# Altium schematic sheet FT65E_SATA.SchDoc: Yaesu FT-65E SATA-interface
size A4; Engineer: CT; SheetNumber: 1; SheetTotal: 1; SPICEModelCacheGVAACYAI: <root> / <DocumentId>GVAACYAI</DocumentId> / </root>
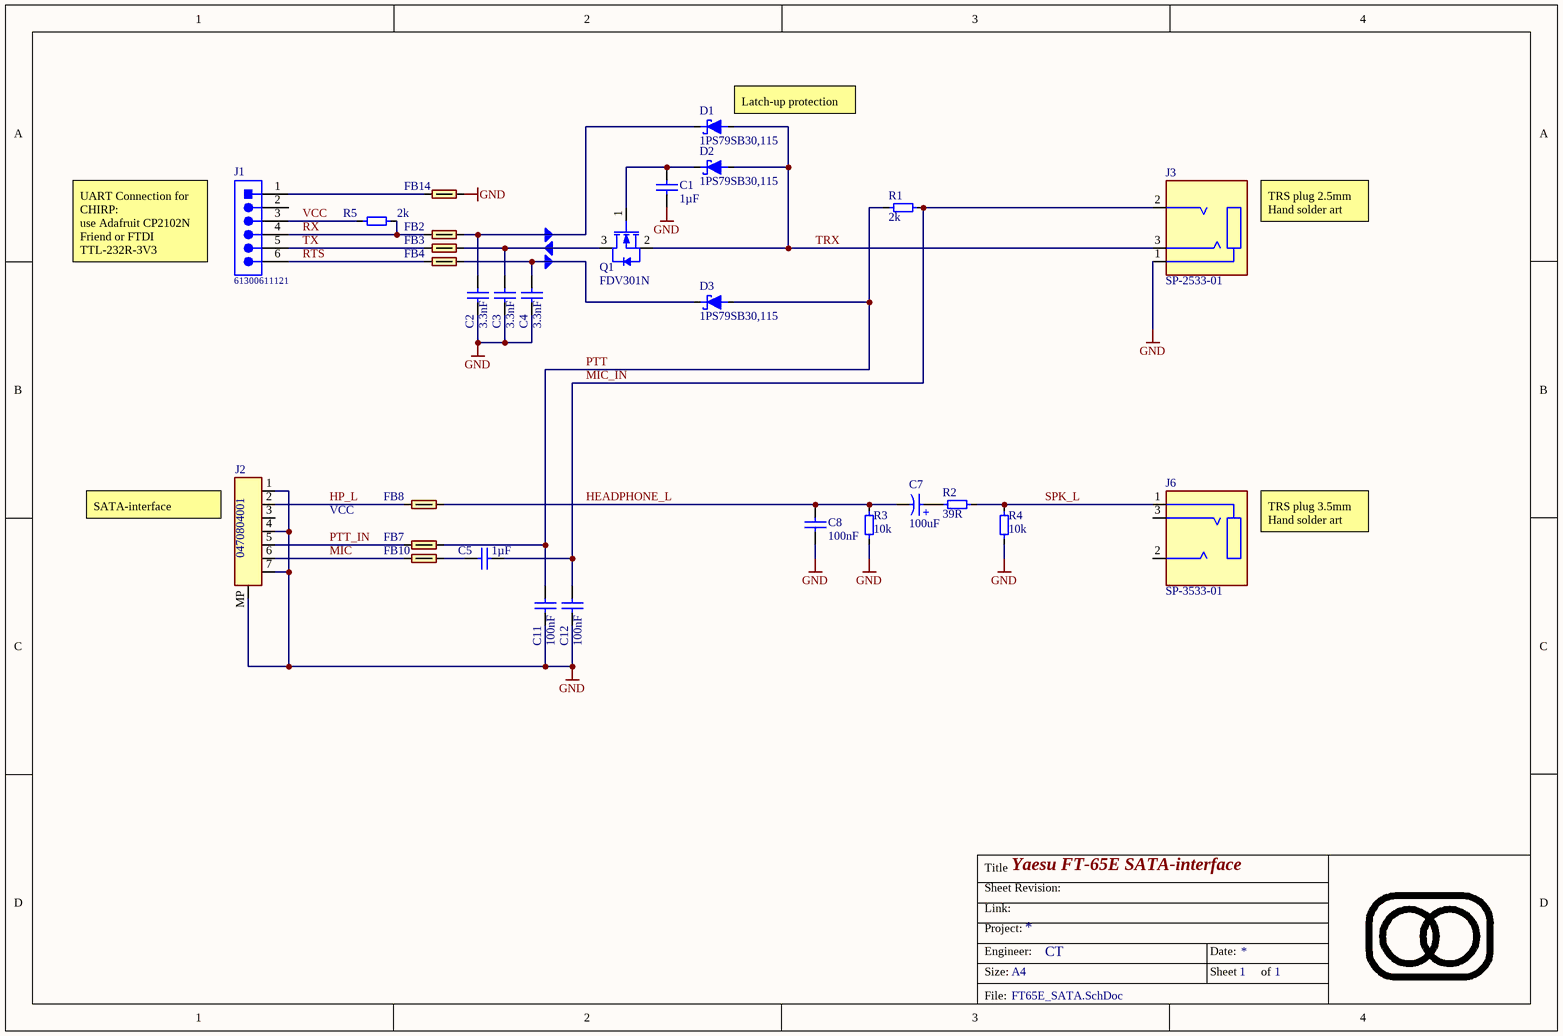
[diagram p0: FT65E_SATA.SchDoc]

## Parts
C1  value 1µF  [0805-C-N]  (hidden comment: Capacitor 1µF +/-10% 10V X7R 0805)
C2  value 3.3nF  [0603-C-N]  (hidden comment: Capacitor 3.3nF +/-10% 50V X7R 0603)
C3  value 3.3nF  [0603-C-N]  (hidden comment: Capacitor 3.3nF +/-10% 50V X7R 0603)
C4  value 3.3nF  [0603-C-N]  (hidden comment: Capacitor 3.3nF +/-10% 50V X7R 0603)
C5  value 1µF  [0805-C-N]  (hidden comment: Capacitor 1µF +/-10% 10V X7R 0805)
C7  Capacitance: 100uF  [WCAP-ASLI_D5H5.5]  (hidden comment: 865080142007)
C8  value 100nF  [0603-C-N]  (hidden comment: Capacitor 100nF +/-10% 50V X7R 0603)
C11  value 100nF  [0603-C-N]  (hidden comment: Capacitor 100nF +/-10% 50V X7R 0603)
C12  value 100nF  [0603-C-N]  (hidden comment: Capacitor 100nF +/-10% 50V X7R 0603)
D1  1PS79SB30,115  [FP-SOD523-MFG]
D2  1PS79SB30,115  [FP-SOD523-MFG]
D3  1PS79SB30,115  [FP-SOD523-MFG]
FB2  742861210  [0603-FB-N]  (value not drawn)
FB3  742861210  [0603-FB-N]  (value not drawn)
FB4  742861210  [0603-FB-N]  (value not drawn)
FB7  742861210  [0603-FB-N]  (value not drawn)
FB8  742861210  [0603-FB-N]  (value not drawn)
FB10  742861210  [0603-FB-N]  (value not drawn)
FB14  742861210  [0603-FB-N]  (value not drawn)
J1  61300611121  [61300611121]
J2  0470804001  [0470804001-Footprint-1]
J3  SP-2533-01  [SP-2533-01-Footprint-1]
J6  SP-3533-01  [SP-3533-01-Footprint-1]
Q1  FDV301N  [SOT-23-3-N]
R1  value 2k  [0603-R-N]  (hidden comment: Resistor 2k +/-1% 50V 0603)
R2  value 39R  [0603-R-N]  (hidden comment: Resistor 39R 0603 +/-1%, 0.1W)
R3  value 10k  [0603-R-N]  (hidden comment: Resistor 10k +/-1% 50V 0603)
R4  value 10k  [0603-R-N]  (hidden comment: Resistor 10k +/-1% 50V 0603)
R5  value 2k  [0603-R-N]  (hidden comment: Resistor 2k +/-1% 50V 0603)

## Nets
GND: C1.1 C2.1 C3.1 C4.1 C8.1 C11.1 C12.1 FB14.2 J2.1 J2.4 J2.7 J2.MP J3.1 R3.1 R4.1
HEADPHONE_L: C7.2(N) C8.2 FB8.2 R3.2
HP_L: FB8.1 J2.2
MIC: FB10.1 J2.6
MIC_IN: C5.1 C12.2 J3.2 R1.2
PTT: C11.2 D3.2(A) FB7.2 R1.1
PTT_IN: FB7.1 J2.5
RTS: FB4.1 J1.6
RX: FB2.1 J1.4 R5.2
SPK_L: J6.1 R2.2 R4.2
TRX: D1.2(A) D2.2(A) J3.3 Q1.2(S)
TX: FB3.1 J1.5
VCC: J1.3 R5.1
NetC1_2: C1.2 D2.1(K) Q1.1(G)
NetC2_2: C2.2 D1.1(K) FB2.2
NetC3_2: C3.2 FB3.2 Q1.3(D)
NetC4_2: C4.2 D3.1(K) FB4.2
NetC5_2: C5.2 FB10.2
NetC7_1: C7.1(P) R2.1
NetFB14_1: FB14.1 J1.1

Not connected (* = marked no-connect by the designer): J1 2; J2 3; J6 2 3

## Notes on the sheet
- (near D1) Latch-up protection
- TRS plug 2.5mm
  Hand solder art
- UART Connection for CHIRP:
  use Adafruit CP2102N Friend or FTDI  TTL-232R-3V3
- (near J2) SATA-interface
- VCC
- TRS plug 3.5mm
  Hand solder art
- Title
- Sheet Revision:
- Link:
- Size:
- Project:
- Engineer:
- A4
- Date:
- Sheet
- of
- File:
- (in symbol CMP-112-000006-2) +

## Library data of the parts
C1 C5 = CMP-072-000659-14: WCAP-CSGP Multilayer Ceramic Chip Capacitor, General Purpose, size 0805, X7R, 1µF, 10VDC; Tolerance: 10%; Capacitor Type: MLCC; Technical Reference: X7R0805105K010DFCT10000; Dissipation Factor: 5%; Insulation Resistance: 0.5GO; Case/Package: 0805; Source: WCAP-CSGP.SchLib; Width: 1.25mm; Pins: 2; ComponentLink2Description: Datasheet Link; Packaging: Tape and Reel; Match Code: WCAP-CSGP; Voltage Rating: 10V; Dielectric: X7R; Min Operating Temperature: -55°C; Mounting Technology: SMT; Max Operating Temperature: 125°C; ComponentLink1URL: https://www.we-online.com/redexpert/article/885012207022?ad; JLCPCB Part #: C28323; Height: 1.25mm; Design Item ID: 885012207022; Usage: General Purpose; ComponentLink1Description: Website Link; ComponentLink2URL: https://www.we-online.com/redexpert/spec/885012207022?ad; Length: 2mm
C2-C4 = CMP-072-000609-11: WCAP-CSGP Multilayer Ceramic Chip Capacitor, General Purpose, size 0603, X7R, 3.3nF, 50VDC; Dissipation Factor: 2.5%; Insulation Resistance: 10GO; Tolerance: 10%; Capacitor Type: MLCC; Technical Reference: X7R0603332K050DFCT10000; ComponentLink2URL: https://www.we-online.com/redexpert/spec/885012206086?ad; ComponentLink2Description: Datasheet Link; Min Operating Temperature: -55°C; Dielectric: X7R; Match Code: WCAP-CSGP; Usage: General Purpose; Design Item ID: 885012206086; Source: WCAP-CSGP.SchLib; Mounting Technology: SMT; Pins: 2; ComponentLink1Description: Website Link; Case/Package: 0603; Length: 1.6mm; ComponentLink1URL: https://www.we-online.com/redexpert/article/885012206086?ad; Width: 0.8mm; Max Operating Temperature: 125°C; Voltage Rating: 50V; Height: 0.8mm; Packaging: Tape and Reel
C7 = CMP-112-000006-2: WCAP-ASLI Aluminum Electrolytic Capacitor, V-Chip, D5 x H5.5mm, 100uF, 6.3V; Manufacturer: Wurth Elektronik; Leakage Current: 6.3uA; Endurance: 2000h; Dissipation Factor: 24%; Capacitance Tolerance: +/-20%; Technical Reference: ASEC055101M6R3DVCTBB000; Ripple Current: 170mA; ComponentLink2URL: https://www.we-online.com/redexpert/spec/865080142007?ad; Operating Temperature Max: 105°C; ComponentLink2Description: Datasheet Link; Packaging: Tape and Reel; Mount: Surface Mount; Diameter: 5mm; Rated Voltage (DC): 6.3V; Source: WCAP-ASLI.SchLib; Height: 5.5mm; Component Type: Standard; Manufacturer Part Number: 865080142007; Operating Temperature Min: -55°C; ComponentLink1URL: https://www.we-online.com/redexpert/article/865080142007?ad; ComponentLink1Description: Website Link; Pin Count: 2; Category: Aluminum Electrolytic Capacitors; Match Code: WCAP-ASLI; Design Item ID: 865080142007
C8 C11 C12 = CMP-001-00017-20: Capacitor MLCC, General Purpose, size 0603, X7R, 100nF, +/-10%, 50V; Tolerance: 10%; RoHS Compliant: True; Capacitor Type: MLCC; Width: 0.8mm; Max Operating Temperature: 125°C; Min Operating Temperature: -55°C; Case/Package: 0603; Usage: General Purpose; Length: 1.6mm; Pins: 2; Voltage Rating: 50V; Height: 0.8mm; Dielectric: X7R; JLCPCB Part #: C14663; Mounting Technology: SMT
D1-D3 = CMP-004-00048-7: VR=40V IF=200mA 20pF; Max Repetitive Reverse Voltage (Vrrm): 40V; Forward Voltage: 600 mV @ 200 mA; Forward Current: 200mA; Case/Package: SOD-523; RoHS Compliant: Yes; JLCPCB Part #: C426690
FB2-FB4 FB7 FB8 FB10 FB14 = CMP-006-00040-1: Ferrite Beads Multi-Layer 1KOhm 25% 100MHz 50mA 1.8Ohm DCR 0603 T/R; Number of Lines: 1; Value: 1.8R; Impedance: 1kR; Width: 0.8mm; Length: 1.6mm; Height: 0.8mm; Packaging: Tape and Reel; Core Material: Ferrite; Reach SVHC Compliant: Unknown; Mounting Technology: Surface Mount; Tolerance: 25%; Case Code (Metric): 1608; RoHS Compliant: Yes; Case/Package: SMD/SMT; Pins: 2; Max DC Current: 50mA; Case Code (Imperial): 0603; Series: WE-CBF HF; Package Quantity: 1; Depth: 0.8mm; Test Frequency: 100MHz; Min Operating Temperature: -55°C; Max Current Rating: 50mA; Max Operating Temperature: 125°C; Termination: SMD/SMT
J1 = CMP-045-000153-3: WR-PHD Pin Header, THT, pitch 2.54mm, Single Row, Vertical, 6p; Manufacturer: Wurth Elektronik; Withstanding Voltage: 500VAC; Working Voltage: 250VAC; Contact Resistance: 20mOhm; Pin Number: 6; Rated Current: 3A; Design Item ID: 61300611121; Component Type: Standard; ComponentLink2URL: https://www.we-online.com/catalog/datasheet/61300611121.pdf; ComponentLink2Description: Datasheet; Manufacturer Part Number: 61300611121; ComponentLink1URL: http://www.we-online.de; Orientation: Vertical; Source: WR-PHD_Pin Header.SchLib; Pitch: 2.54mm; Operating Temperature: -40 to +105degC; ComponentLink1Description: Manufacturer; Row Number: Single; Gender: Pin Header; Pin Count: 6; Mounting Technology: THT; Packaging: Bag
J2 = CMP-002-00132-1: Header Connector, pcb Mount, recept, 7 Contacts, pin, 0.05 Pitch, surface Mount Terminal, locking; pin to pad: MP>MP1+MP2; Number of Ports: 1; Pitch: 1.27mm; Termination: Solder; Max Operating Temperature: 85°C; Min Operating Temperature: -35°C; Housing Material: Plastic; Depth: 11.56mm; Orientation: Right Angle; Packaging: Tape and Reel; Contact Plating: Gold; Contact Material: Copper Alloy; Length: 17.54mm; JLCPCB Part #: C587821
J3 = CMP-002-00129-3: 2.5 mm, Stereo, Overmold, Audio Plug Connector; pin to pad: 2>2A+2B 3>3A+3B; Body Material: Brass; Gender: Male; Current Rating: 1A; Shielding: Unshielded; Contact Material: Brass; Contact Plating: Nickel; Mounting Technology: Free Hanging; Termination: Solder; Connector Type: Plug; Min Operating Temperature: -25°C; Insulation Color: Black; Max Operating Temperature: 70°C; Packaging: Bulk
J6 = CMP-002-00130-2: 3.5 mm, Stereo, Overmold, Audio Plug Connector; pin to pad: 2>2A+2B 3>3A+3B; Shielding: Unshielded; Body Material: Brass; Gender: Male; Current Rating: 1A; Insulation Color: Black; RoHS Compliant: Yes; Max Operating Temperature: 70°C; Packaging: Bulk; Housing Material: Brass; Contact Material: Brass; Contact Plating: Nickel; Termination: Solder; Mounting Technology: Free Hanging; Connector Type: Plug; Min Operating Temperature: -25°C
Q1 = CMP-013-00055-10: Transistor MOSFET N-Ch. 25V 220mA 0, 35W 4Ohm SOT23; Polarity: N-CHANNEL; Max Power Dissipation: 350mW; Transistor Type: NMOS; Gate to Source Voltage (Vgs): 8V; Fall Time: 6ns; Turn-Off Delay Time: 3.5ns; Drain to Source Resistance: 5R; Vgs(th) (Max) @ Id: 1.06V @250µA; Number of Channels: 1; Rds On Max: 4R; Input Capacitance: 9.5pF; Turn-On Delay Time: 3.2ns; Id - Continuous Drain Current: 220mA; Series: -; Width: 1.3mm; Case/Package: SOT-23-3; Height: 1.2mm; Mounting Technology: Surface Mount; Weight: 0.001093oz; Drain to Source Voltage (Vdss): 25V; Pins: 3; Packaging: Tape and Reel; Length: 2.9mm; Rise Time: 6ns; Vgs (Max): 8V; JLCPCB Part #: C15310; Package Quantity: 3000; Max Operating Temperature: 150°C; Vds Max: 25V; Continuous Drain Current (ID): 220mA; Min Operating Temperature: -55°C
R1 R5 = CMP-009-00298-9: Chip Resistor, Thick Film, General Purpose, 0603, 100mW, 50V, 2 kOhm, +/-1%; Tolerance: 1%; Elements: 1; Mounting Technology: SMT; Max Operating Temperature: 155°C; Pins: 2; Resistor Type: Thick Film; Usage: General Purpose; Power Rating: 100mW; JLCPCB Part #: C22975; Case/Package: 0603; Min Operating Temperature: -55°C; Voltage Rating: 50V
R2 = CMP-009-00363-2: SMD Chip Resistor, 39 Ohm, ± 1%, 100 mW, 0603 [1608 Metric], Thick Film, General Purpose; Temperature Coefficient: 100ppm/°C; Power Rating: 100mW; Voltage Rating: 50V; Elements: 1; Max Operating Temperature: 155°C; Lead Free: Lead Free; Pins: 2; RoHS Compliant: Yes; Tolerance: 1%; Resistor Type: Thick Film; Min Operating Temperature: -55°C; Features: Moisture Resistant; JLCPCB Part #: C2907161; Case/Package: 0603; Mounting Technology: SMT; Usage: General Purpose
R3 R4 = CMP-009-00017-24: Chip Resistor, Thick Film, General Purpose, 0603, 100mW, 50V, 10 kOhm, +/-1%; Tolerance: 1%; Elements: 1; Power Rating: 100mW; RoHS Compliant: Yes; Voltage Rating: 50V; Mounting Technology: SMT; Usage: General Purpose; JLCPCB Part #: C25804; Max Operating Temperature: 155°C; Case/Package: 0603; Pins: 2; Resistor Type: Thick Film; Min Operating Temperature: -55°C